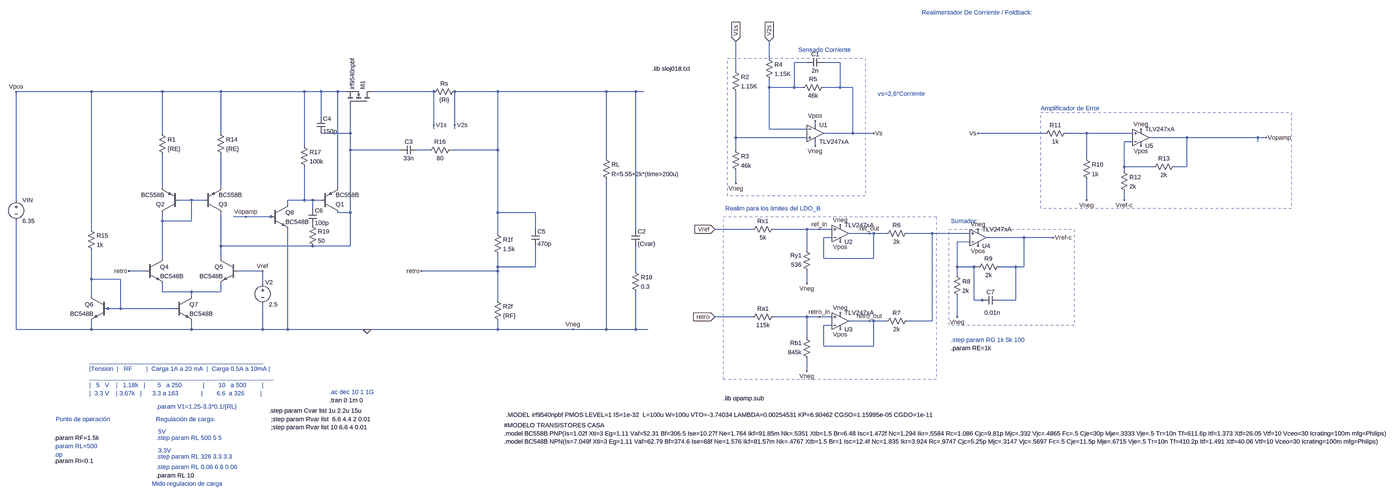
[diagram p0: schematic 2024-10-01 Cambio_RL_abrupto.asc, whole sheet]
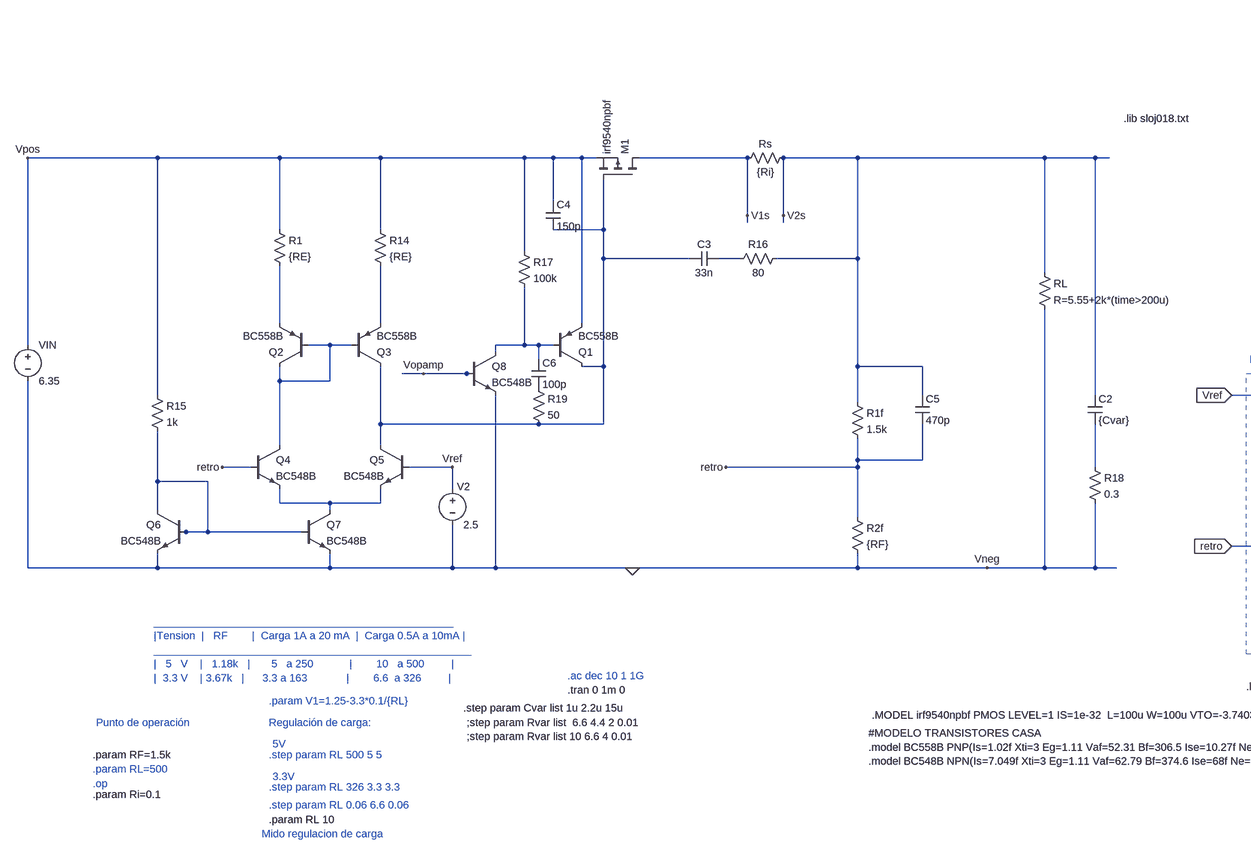
[diagram p1: schematic 2024-10-01 Cambio_RL_abrupto.asc, part, row 1 of 1, column 1 of 2]
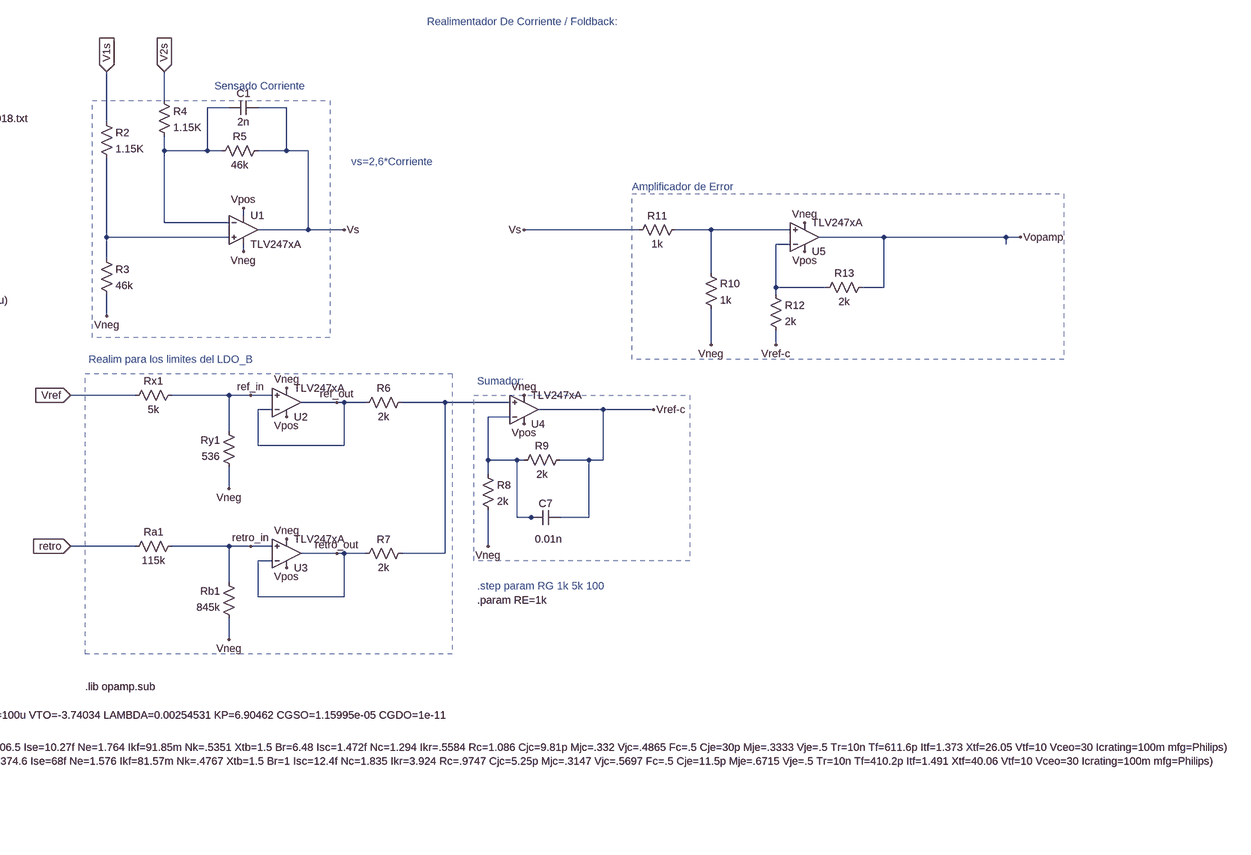
[diagram p2: schematic 2024-10-01 Cambio_RL_abrupto.asc, part, row 1 of 1, column 2 of 2]
2024-10-01 Cambio_RL_abrupto.asc, the LTspice schematic file:
Version 4
SHEET 1 6700 2000
WIRE 2176 -160 2176 -224
WIRE 2320 -144 2272 -144
WIRE 2448 -144 2384 -144
WIRE 2048 -112 2048 -224
WIRE 2176 -48 2176 -80
WIRE 2272 -48 2272 -144
WIRE 2272 -48 2176 -48
WIRE 2304 -48 2272 -48
WIRE 2448 -48 2448 -144
WIRE 2448 -48 2384 -48
WIRE 2496 -48 2448 -48
WIRE -496 -32 -784 -32
WIRE -224 -32 -496 -32
WIRE 0 -32 -224 -32
WIRE 320 -32 0 -32
WIRE 384 -32 320 -32
WIRE 448 -32 384 -32
WIRE 480 -32 448 -32
WIRE 816 -32 576 -32
WIRE 1136 -32 896 -32
WIRE 1552 -32 1136 -32
WIRE 1664 -32 1552 -32
WIRE 1696 -32 1664 -32
WIRE 384 64 384 -32
WIRE 816 96 816 -32
WIRE 896 96 896 -32
WIRE 2352 96 2352 80
WIRE 816 112 816 96
WIRE 896 112 896 96
WIRE 2176 112 2176 -48
WIRE 2320 112 2176 112
WIRE -224 128 -224 -32
WIRE 0 128 0 -32
WIRE 496 128 496 16
WIRE 496 128 384 128
WIRE 2496 128 2496 -48
WIRE 2496 128 2384 128
WIRE 2576 128 2496 128
WIRE 3232 128 2976 128
WIRE 3392 128 3312 128
WIRE 3568 128 3392 128
WIRE 2048 144 2048 -32
WIRE 2320 144 2048 144
WIRE 3776 144 3632 144
WIRE 4048 144 3776 144
WIRE 4080 144 4048 144
WIRE 3568 160 3536 160
WIRE 4048 160 4048 144
WIRE 320 176 320 -32
WIRE 2352 176 2352 160
WIRE 496 192 496 128
WIRE 688 192 496 192
WIRE 800 192 752 192
WIRE 1136 192 1136 -32
WIRE 1136 192 880 192
WIRE 2048 192 2048 144
WIRE 1552 224 1552 -32
WIRE 3392 224 3392 128
WIRE 3536 256 3536 160
WIRE 3648 256 3536 256
WIRE 3776 256 3776 144
WIRE 3776 256 3728 256
WIRE 3536 272 3536 256
WIRE 2048 320 2048 272
WIRE -224 336 -224 208
WIRE 0 336 0 208
WIRE 448 336 448 -32
WIRE -784 384 -784 -32
WIRE -112 384 -160 384
WIRE -64 384 -112 384
WIRE 320 384 320 256
WIRE 320 384 256 384
WIRE 352 384 320 384
WIRE 384 384 352 384
WIRE 3392 384 3392 304
WIRE 3536 384 3536 352
WIRE 256 400 256 384
WIRE 352 416 352 384
WIRE 496 432 496 192
WIRE 496 432 448 432
WIRE 1136 432 1136 192
WIRE 1280 432 1136 432
WIRE 96 448 48 448
WIRE 192 448 96 448
WIRE 208 448 192 448
WIRE -224 464 -224 432
WIRE -112 464 -112 384
WIRE -112 464 -224 464
WIRE -496 496 -496 -32
WIRE 1280 496 1280 432
WIRE 1664 496 1664 -32
WIRE 2112 496 1968 496
WIRE 2320 496 2192 496
WIRE 2368 496 2320 496
WIRE 2416 496 2368 496
WIRE 1136 512 1136 432
WIRE 2560 512 2480 512
WIRE 2576 512 2560 512
WIRE 2624 512 2576 512
WIRE 2800 512 2704 512
WIRE 2944 512 2800 512
WIRE 2416 528 2384 528
WIRE 3152 528 3008 528
WIRE 3264 528 3152 528
WIRE 2944 544 2896 544
WIRE 0 560 0 432
WIRE 352 560 0 560
WIRE 496 560 496 432
WIRE 496 560 352 560
WIRE 2320 576 2320 496
WIRE -224 608 -224 464
WIRE 0 608 0 560
WIRE 2384 608 2384 528
WIRE 2576 608 2576 512
WIRE 2576 608 2384 608
WIRE 1136 640 1136 592
WIRE 1280 640 1280 560
WIRE 1280 640 1136 640
WIRE 2896 640 2896 544
WIRE 2960 640 2896 640
WIRE 2976 640 2960 640
WIRE 3120 640 3056 640
WIRE 3152 640 3152 528
WIRE 3152 640 3120 640
WIRE -288 656 -352 656
WIRE 160 656 64 656
WIRE 1136 656 1136 640
WIRE 1136 656 768 656
WIRE 1664 656 1664 560
WIRE 2896 672 2896 640
WIRE -496 688 -496 576
WIRE -384 688 -496 688
WIRE 160 704 160 656
WIRE 2320 704 2320 656
WIRE -224 736 -224 704
WIRE -112 736 -224 736
WIRE 0 736 0 704
WIRE 0 736 -112 736
WIRE -496 752 -496 688
WIRE -112 752 -112 736
WIRE 1136 768 1136 656
WIRE 2960 768 2960 640
WIRE 2992 768 2960 768
WIRE 3008 768 2992 768
WIRE 3120 768 3120 640
WIRE 3120 768 3056 768
WIRE -432 800 -448 800
WIRE -384 800 -384 688
WIRE -384 800 -432 800
WIRE -176 800 -384 800
WIRE 2112 832 1968 832
WIRE 2320 832 2192 832
WIRE 2368 832 2320 832
WIRE 2416 832 2368 832
WIRE 2896 832 2896 752
WIRE 2560 848 2480 848
WIRE 2576 848 2560 848
WIRE 2624 848 2576 848
WIRE 2800 848 2800 512
WIRE 2800 848 2704 848
WIRE 2416 864 2384 864
WIRE -784 880 -784 464
WIRE -496 880 -496 848
WIRE -496 880 -784 880
WIRE -112 880 -112 848
WIRE -112 880 -496 880
WIRE 160 880 160 784
WIRE 160 880 -112 880
WIRE 256 880 256 496
WIRE 256 880 160 880
WIRE 560 880 256 880
WIRE 1136 880 1136 848
WIRE 1136 880 560 880
WIRE 1424 880 1136 880
WIRE 1552 880 1552 304
WIRE 1552 880 1424 880
WIRE 1664 880 1664 736
WIRE 1664 880 1552 880
WIRE 1712 880 1664 880
WIRE 2320 912 2320 832
WIRE 2384 944 2384 864
WIRE 2576 944 2576 848
WIRE 2576 944 2384 944
WIRE 2320 1040 2320 992
FLAG 560 880 0
FLAG -784 -32 Vpos
FLAG 2576 128 Vs
FLAG 2048 -224 V1s
IOPIN 2048 -224 In
FLAG 2176 -224 V2s
IOPIN 2176 -224 In
FLAG 1968 496 Vref
IOPIN 1968 496 In
FLAG 1968 832 retro
IOPIN 1968 832 In
FLAG 3264 528 Vref-c
FLAG 3536 384 Vref-c
FLAG 2352 80 Vpos
FLAG 3600 176 Vpos
FLAG 2976 560 Vpos
FLAG 2448 544 Vpos
FLAG 2448 880 Vpos
FLAG 2352 176 Vneg
FLAG 3600 112 Vneg
FLAG 2048 320 Vneg
FLAG 2320 704 Vneg
FLAG 3392 384 Vneg
FLAG 2320 1040 Vneg
FLAG 2896 832 Vneg
FLAG 2976 496 Vneg
FLAG 2448 816 Vneg
FLAG 2448 480 Vneg
FLAG 816 96 V1s
FLAG 896 96 V2s
FLAG 1424 880 Vneg
FLAG 2368 496 ref_in
FLAG 2368 832 retro_in
FLAG 2560 848 retro_out
FLAG 2560 512 ref_out
FLAG 160 656 Vref
FLAG 4080 144 Vopamp
FLAG -352 656 retro
FLAG 2976 128 Vs
FLAG 768 656 retro
FLAG 96 448 Vopamp
DATAFLAG 1040 -32 ""
DATAFLAG 96 -32 ""
SYMBOL res 1536 208 R0
SYMATTR InstName RL
SYMATTR Value R=5.55+2k*(time>200u)
SYMBOL voltage -784 368 R0
WINDOW 123 24 124 Left 2
WINDOW 39 0 0 Left 0
SYMATTR InstName VIN
SYMATTR Value 6.35
SYMBOL res 1120 496 R0
SYMATTR InstName R1f
SYMATTR Value 1.5k
SYMBOL res 1120 752 R0
SYMATTR InstName R2f
SYMATTR Value {RF}
SYMBOL res 912 -48 R90
WINDOW 0 0 56 VBottom 2
WINDOW 3 32 56 VTop 2
SYMATTR InstName Rs
SYMATTR Value {Ri}
SYMBOL Res 2032 -128 R0
SYMATTR InstName R2
SYMATTR Value 1.15K
SYMBOL Res 2032 176 R0
SYMATTR InstName R3
SYMATTR Value 46k
SYMBOL Res 2160 -176 R0
SYMATTR InstName R4
SYMATTR Value 1.15K
SYMBOL Res 2400 -64 R90
WINDOW 0 0 56 VBottom 2
WINDOW 3 32 56 VTop 2
SYMATTR InstName R5
SYMATTR Value 46k
SYMBOL Res 2208 480 R90
WINDOW 0 0 56 VBottom 2
WINDOW 3 32 56 VTop 2
SYMATTR InstName Rx1
SYMATTR Value 5k
SYMBOL Res 2336 672 R180
WINDOW 0 36 76 Left 2
WINDOW 3 36 40 Left 2
SYMATTR InstName Ry1
SYMATTR Value 536
SYMBOL Res 2208 816 R90
WINDOW 0 0 56 VBottom 2
WINDOW 3 32 56 VTop 2
SYMATTR InstName Ra1
SYMATTR Value 115k
SYMBOL Res 2336 1008 R180
WINDOW 0 36 76 Left 2
WINDOW 3 36 40 Left 2
SYMATTR InstName Rb1
SYMATTR Value 845k
SYMBOL Res 2720 496 R90
WINDOW 0 0 56 VBottom 2
WINDOW 3 32 56 VTop 2
SYMATTR InstName R6
SYMATTR Value 2k
SYMBOL Res 2720 832 R90
WINDOW 0 0 56 VBottom 2
WINDOW 3 32 56 VTop 2
SYMATTR InstName R7
SYMATTR Value 2k
SYMBOL Res 2880 656 R0
SYMATTR InstName R8
SYMATTR Value 2k
SYMBOL Res 3072 624 R90
WINDOW 0 0 56 VBottom 2
WINDOW 3 32 56 VTop 2
SYMATTR InstName R9
SYMATTR Value 2k
SYMBOL Res 3376 208 R0
SYMATTR InstName R10
SYMATTR Value 1k
SYMBOL Res 3328 112 R90
WINDOW 0 0 56 VBottom 2
WINDOW 3 32 56 VTop 2
SYMATTR InstName R11
SYMATTR Value 1k
SYMBOL Res 3520 256 R0
SYMATTR InstName R12
SYMATTR Value 2k
SYMBOL Res 3744 240 R90
WINDOW 0 0 56 VBottom 2
WINDOW 3 32 56 VTop 2
SYMATTR InstName R13
SYMATTR Value 2k
SYMBOL pnp -160 432 R180
SYMATTR InstName Q2
SYMATTR Value BC558B
SYMBOL pnp -64 432 M180
SYMATTR InstName Q3
SYMATTR Value BC558B
SYMBOL npn -288 608 R0
SYMATTR InstName Q4
SYMATTR Value BC548B
SYMBOL npn 64 608 M0
SYMATTR InstName Q5
SYMATTR Value BC548B
SYMBOL res -240 112 R0
SYMATTR InstName R1
SYMATTR Value {RE}
SYMBOL res -16 112 R0
SYMATTR InstName R14
SYMATTR Value {RE}
SYMBOL res -512 480 R0
SYMATTR InstName R15
SYMATTR Value 1k
SYMBOL npn -432 752 M0
SYMATTR InstName Q6
SYMATTR Value BC548B
SYMBOL npn -176 752 R0
SYMATTR InstName Q7
SYMATTR Value BC548B
SYMBOL pmos 576 16 M270
SYMATTR InstName M1
SYMATTR Value irf9540npbf
SYMBOL voltage 160 688 R0
WINDOW 0 10 11 Left 2
WINDOW 123 0 0 Left 0
WINDOW 39 0 0 Left 0
SYMATTR InstName V2
SYMATTR Value 2.5
SYMBOL pnp 384 432 M180
SYMATTR InstName Q1
SYMATTR Value BC558B
SYMBOL npn 192 400 R0
SYMATTR InstName Q8
SYMATTR Value BC548B
SYMBOL res 304 160 R0
SYMATTR InstName R17
SYMATTR Value 100k
SYMBOL cap 1648 496 R0
SYMATTR InstName C2
SYMATTR Value {Cvar}
SYMBOL cap 752 176 R90
WINDOW 0 0 32 VBottom 2
WINDOW 3 32 32 VTop 2
SYMATTR InstName C3
SYMATTR Value 33n
SYMBOL res 896 176 R90
WINDOW 0 0 56 VBottom 2
WINDOW 3 32 56 VTop 2
SYMATTR InstName R16
SYMATTR Value 80
SYMBOL cap 368 64 R0
SYMATTR InstName C4
SYMATTR Value 150p
SYMBOL cap 1264 496 R0
SYMATTR InstName C5
SYMATTR Value 470p
SYMBOL res 1648 640 R0
SYMATTR InstName R18
SYMATTR Value 0.3
SYMBOL cap 336 416 R0
SYMATTR InstName C6
SYMATTR Value 100p
SYMBOL res 336 464 R0
SYMATTR InstName R19
SYMATTR Value 50
SYMBOL opamp2 2352 64 R0
SYMATTR InstName U1
SYMATTR Value TLV247xA
SYMBOL opamp2 2448 576 M180
SYMATTR InstName U2
SYMATTR Value TLV247xA
SYMBOL opamp2 2448 912 M180
SYMATTR InstName U3
SYMATTR Value TLV247xA
SYMBOL opamp2 2976 592 M180
SYMATTR InstName U4
SYMATTR Value TLV247xA
SYMBOL opamp2 3600 208 M180
SYMATTR InstName U5
SYMATTR Value TLV247xA
SYMBOL cap 2384 -160 R90
WINDOW 0 0 32 VBottom 2
WINDOW 3 32 32 VTop 2
SYMATTR InstName C1
SYMATTR Value 2n
SYMBOL cap 3056 752 R90
WINDOW 0 0 32 VBottom 2
WINDOW 3 48 25 VTop 2
SYMATTR InstName C7
SYMATTR Value 0.01n
TEXT -640 1360 Left 2 ;.op
TEXT -248 1296 Left 2 ;.step param RL 500 5 5
TEXT 1168 1208 Left 2 !.MODEL irf9540npbf PMOS LEVEL=1 IS=1e-32  L=100u W=100u VTO=-3.74034 LAMBDA=0.00254531 KP=6.90462 CGSO=1.15995e-05 CGDO=1e-11
TEXT -640 1328 Left 2 ;.param RL=500
TEXT -248 1224 Left 2 ;Regulación de carga:
TEXT -640 1296 Left 2 !.param RF=1.5k
TEXT -632 1224 Left 2 ;Punto de operación
TEXT -240 1272 Left 2 ;5V
TEXT -240 1344 Left 2 ;3.3V
TEXT -248 1368 Left 2 ;.step param RL 326 3.3 3.3
TEXT -264 1472 Left 2 ;Mido regulacion de carga
TEXT -504 1000 Left 2 ;__________________________________________________\n|Tension  |   RF        |  Carga 1A a 20 mA  |  Carga 0.5A a 10mA |\n_____________________________________________________\n|   5   V    |   1.18k   |       5   a 250            |        10   a 500         |\n|  3.3 V    | 3.67k   |      3.3 a 163             |        6.6  a 326         |
TEXT -640 1384 Left 2 !.param Ri=0.1
TEXT -248 1408 Left 2 ;.step param RL 0.06 6.6 0.06
TEXT 2760 -336 Left 2 ;Realimentador De Corriente / Foldback:
TEXT 2288 -192 Left 2 ;Sensado Corriente
TEXT 2008 416 Left 2 ;Realim para los limites del LDO_B
TEXT 2872 464 Left 2 ;Sumador:
TEXT 3216 32 Left 2 ;Amplificador de Error
TEXT 2000 1144 Left 2 !.lib opamp.sub
TEXT 2872 920 Left 2 ;.step param RG 1k 5k 100
TEXT 2872 952 Left 2 !.param RE=1k
TEXT 1160 1248 Left 2 !#MODELO TRANSISTORES CASA\n.model BC558B PNP(Is=1.02f Xti=3 Eg=1.11 Vaf=52.31 Bf=306.5 Ise=10.27f Ne=1.764 Ikf=91.85m Nk=.5351 Xtb=1.5 Br=6.48 Isc=1.472f Nc=1.294 Ikr=.5584 Rc=1.086 Cjc=9.81p Mjc=.332 Vjc=.4865 Fc=.5 Cje=30p Mje=.3333 Vje=.5 Tr=10n Tf=611.6p Itf=1.373 Xtf=26.05 Vtf=10 Vceo=30 Icrating=100m mfg=Philips)\n.model BC548B NPN(Is=7.049f Xti=3 Eg=1.11 Vaf=62.79 Bf=374.6 Ise=68f Ne=1.576 Ikf=81.57m Nk=.4767 Xtb=1.5 Br=1 Isc=12.4f Nc=1.835 Ikr=3.924 Rc=.9747 Cjc=5.25p Mjc=.3147 Vjc=.5697 Fc=.5 Cje=11.5p Mje=.6715 Vje=.5 Tr=10n Tf=410.2p Itf=1.491 Xtf=40.06 Vtf=10 Vceo=30 Icrating=100m mfg=Philips)
TEXT -248 1176 Left 2 ;.param V1=1.25-3.3*0.1/{RL}
TEXT -248 1440 Left 2 !.param RL 10
TEXT 2592 -24 Left 2 ;vs=2,6*Corriente
TEXT 416 1120 Left 2 ;.ac dec 10 1 1G
TEXT 1728 -120 Left 2 !.lib sloj018.txt
TEXT 184 1192 Left 2 !.step param Cvar list 1u 2.2u 15u
TEXT 416 1152 Left 2 !.tran 0 1m 0
TEXT 192 1224 Left 2 !;step param Rvar list  6.6 4.4 2 0.01\n;step param Rvar list 10 6.6 4 0.01
RECTANGLE Normal 3344 864 2864 496 2
RECTANGLE Normal 2816 1072 2000 448 2
RECTANGLE Normal 4176 416 3216 48 2
RECTANGLE Normal 2544 368 2016 -160 2

The netlist it stands for:
* 2024-10-01 Cambio_RL_abrupto.asc
RL V2s 0 R=5.55+2k*(time>200u)
VIN Vpos 0 6.35
R1f V2s retro 1.5k
R2f retro 0 {RF}
Rs V2s V1s {Ri}
R2 V1s N004 1.15K
R3 N004 0 46k
R4 V2s N001 1.15K
R5 Vs N001 46k
Rx1 ref_in Vref 5k
Ry1 0 ref_in 536
Ra1 retro_in retro 115k
Rb1 0 retro_in 845k
R6 N011 ref_out 2k
R7 N011 retro_out 2k
R8 N012 0 2k
R9 Vref-c N012 2k
R10 N003 0 1k
R11 N003 Vs 1k
R12 N005 Vref-c 2k
R13 Vopamp N005 2k
Q2 N009 N009 N007 0 BC558B
Q3 N002 N009 N008 0 BC558B
Q4 N009 retro N015 0 BC548B
Q5 N002 Vref N015 0 BC548B
R1 Vpos N007 {RE}
R14 Vpos N008 {RE}
R15 Vpos N014 1k
Q6 N014 N014 0 0 BC548B
Q7 N015 N014 0 0 BC548B
M1 V1s N002 Vpos Vpos irf9540npbf
V2 Vref 0 2.5
Q1 N002 N010 Vpos 0 BC558B
Q8 N010 Vopamp 0 0 BC548B
R17 Vpos N010 100k
C2 V2s N013 {Cvar}
C3 N006 N002 33n
R16 V2s N006 80
C4 Vpos N002 150p
C5 V2s retro 470p
R18 N013 0 0.3
C6 N010 P001 100p
R19 P001 N002 50
XU1 N004 N001 Vpos 0 Vs TLV247xA  ; pins In+ In- V+ V- OUT
XU2 ref_in ref_out Vpos 0 ref_out TLV247xA  ; pins In+ In- V+ V- OUT
XU3 retro_in retro_out Vpos 0 retro_out TLV247xA  ; pins In+ In- V+ V- OUT
XU4 N011 N012 Vpos 0 Vref-c TLV247xA  ; pins In+ In- V+ V- OUT
XU5 N003 N005 Vpos 0 Vopamp TLV247xA  ; pins In+ In- V+ V- OUT
C1 Vs N001 2n
C7 Vref-c N012 0.01n
.model NPN NPN
.model PNP PNP
.lib standard.bjt
.model NMOS NMOS
.model PMOS PMOS
.lib standard.mos
* .op
* .step param RL 500 5 5
.MODEL irf9540npbf PMOS LEVEL=1 IS=1e-32  L=100u W=100u VTO=-3.74034 LAMBDA=0.00254531 KP=6.90462 CGSO=1.15995e-05 CGDO=1e-11
* .param RL=500
* Regulación de carga:
.param RF=1.5k
* Punto de operación
* 5V
* 3.3V
* .step param RL 326 3.3 3.3
* Mido regulacion de carga
* __________________________________________________
* |Tension  |   RF        |  Carga 1A a 20 mA  |  Carga 0.5A a 10mA |
* _____________________________________________________
* |   5   V    |   1.18k   |       5   a 250            |        10   a 500         |
* |  3.3 V    | 3.67k   |      3.3 a 163             |        6.6  a 326         |
.param Ri=0.1
* .step param RL 0.06 6.6 0.06
* Realimentador De Corriente / Foldback:
* Sensado Corriente
* Realim para los limites del LDO_B
* Sumador:
* Amplificador de Error
.lib opamp.sub
* .step param RG 1k 5k 100
.param RE=1k
#MODELO TRANSISTORES CASA
.model BC558B PNP(Is=1.02f Xti=3 Eg=1.11 Vaf=52.31 Bf=306.5 Ise=10.27f Ne=1.764 Ikf=91.85m Nk=.5351 Xtb=1.5 Br=6.48 Isc=1.472f Nc=1.294 Ikr=.5584 Rc=1.086 Cjc=9.81p Mjc=.332 Vjc=.4865 Fc=.5 Cje=30p Mje=.3333 Vje=.5 Tr=10n Tf=611.6p Itf=1.373 Xtf=26.05 Vtf=10 Vceo=30 Icrating=100m mfg=Philips)
.model BC548B NPN(Is=7.049f Xti=3 Eg=1.11 Vaf=62.79 Bf=374.6 Ise=68f Ne=1.576 Ikf=81.57m Nk=.4767 Xtb=1.5 Br=1 Isc=12.4f Nc=1.835 Ikr=3.924 Rc=.9747 Cjc=5.25p Mjc=.3147 Vjc=.5697 Fc=.5 Cje=11.5p Mje=.6715 Vje=.5 Tr=10n Tf=410.2p Itf=1.491 Xtf=40.06 Vtf=10 Vceo=30 Icrating=100m mfg=Philips)
* .param V1=1.25-3.3*0.1/{RL}
.param RL 10
* vs=2,6*Corriente
* .ac dec 10 1 1G
.lib sloj018.txt
.step param Cvar list 1u 2.2u 15u
.tran 0 1m 0
;step param Rvar list  6.6 4.4 2 0.01
;step param Rvar list 10 6.6 4 0.01
.backanno
.end